# Altium project ESP32 with USBC.PrjPcb
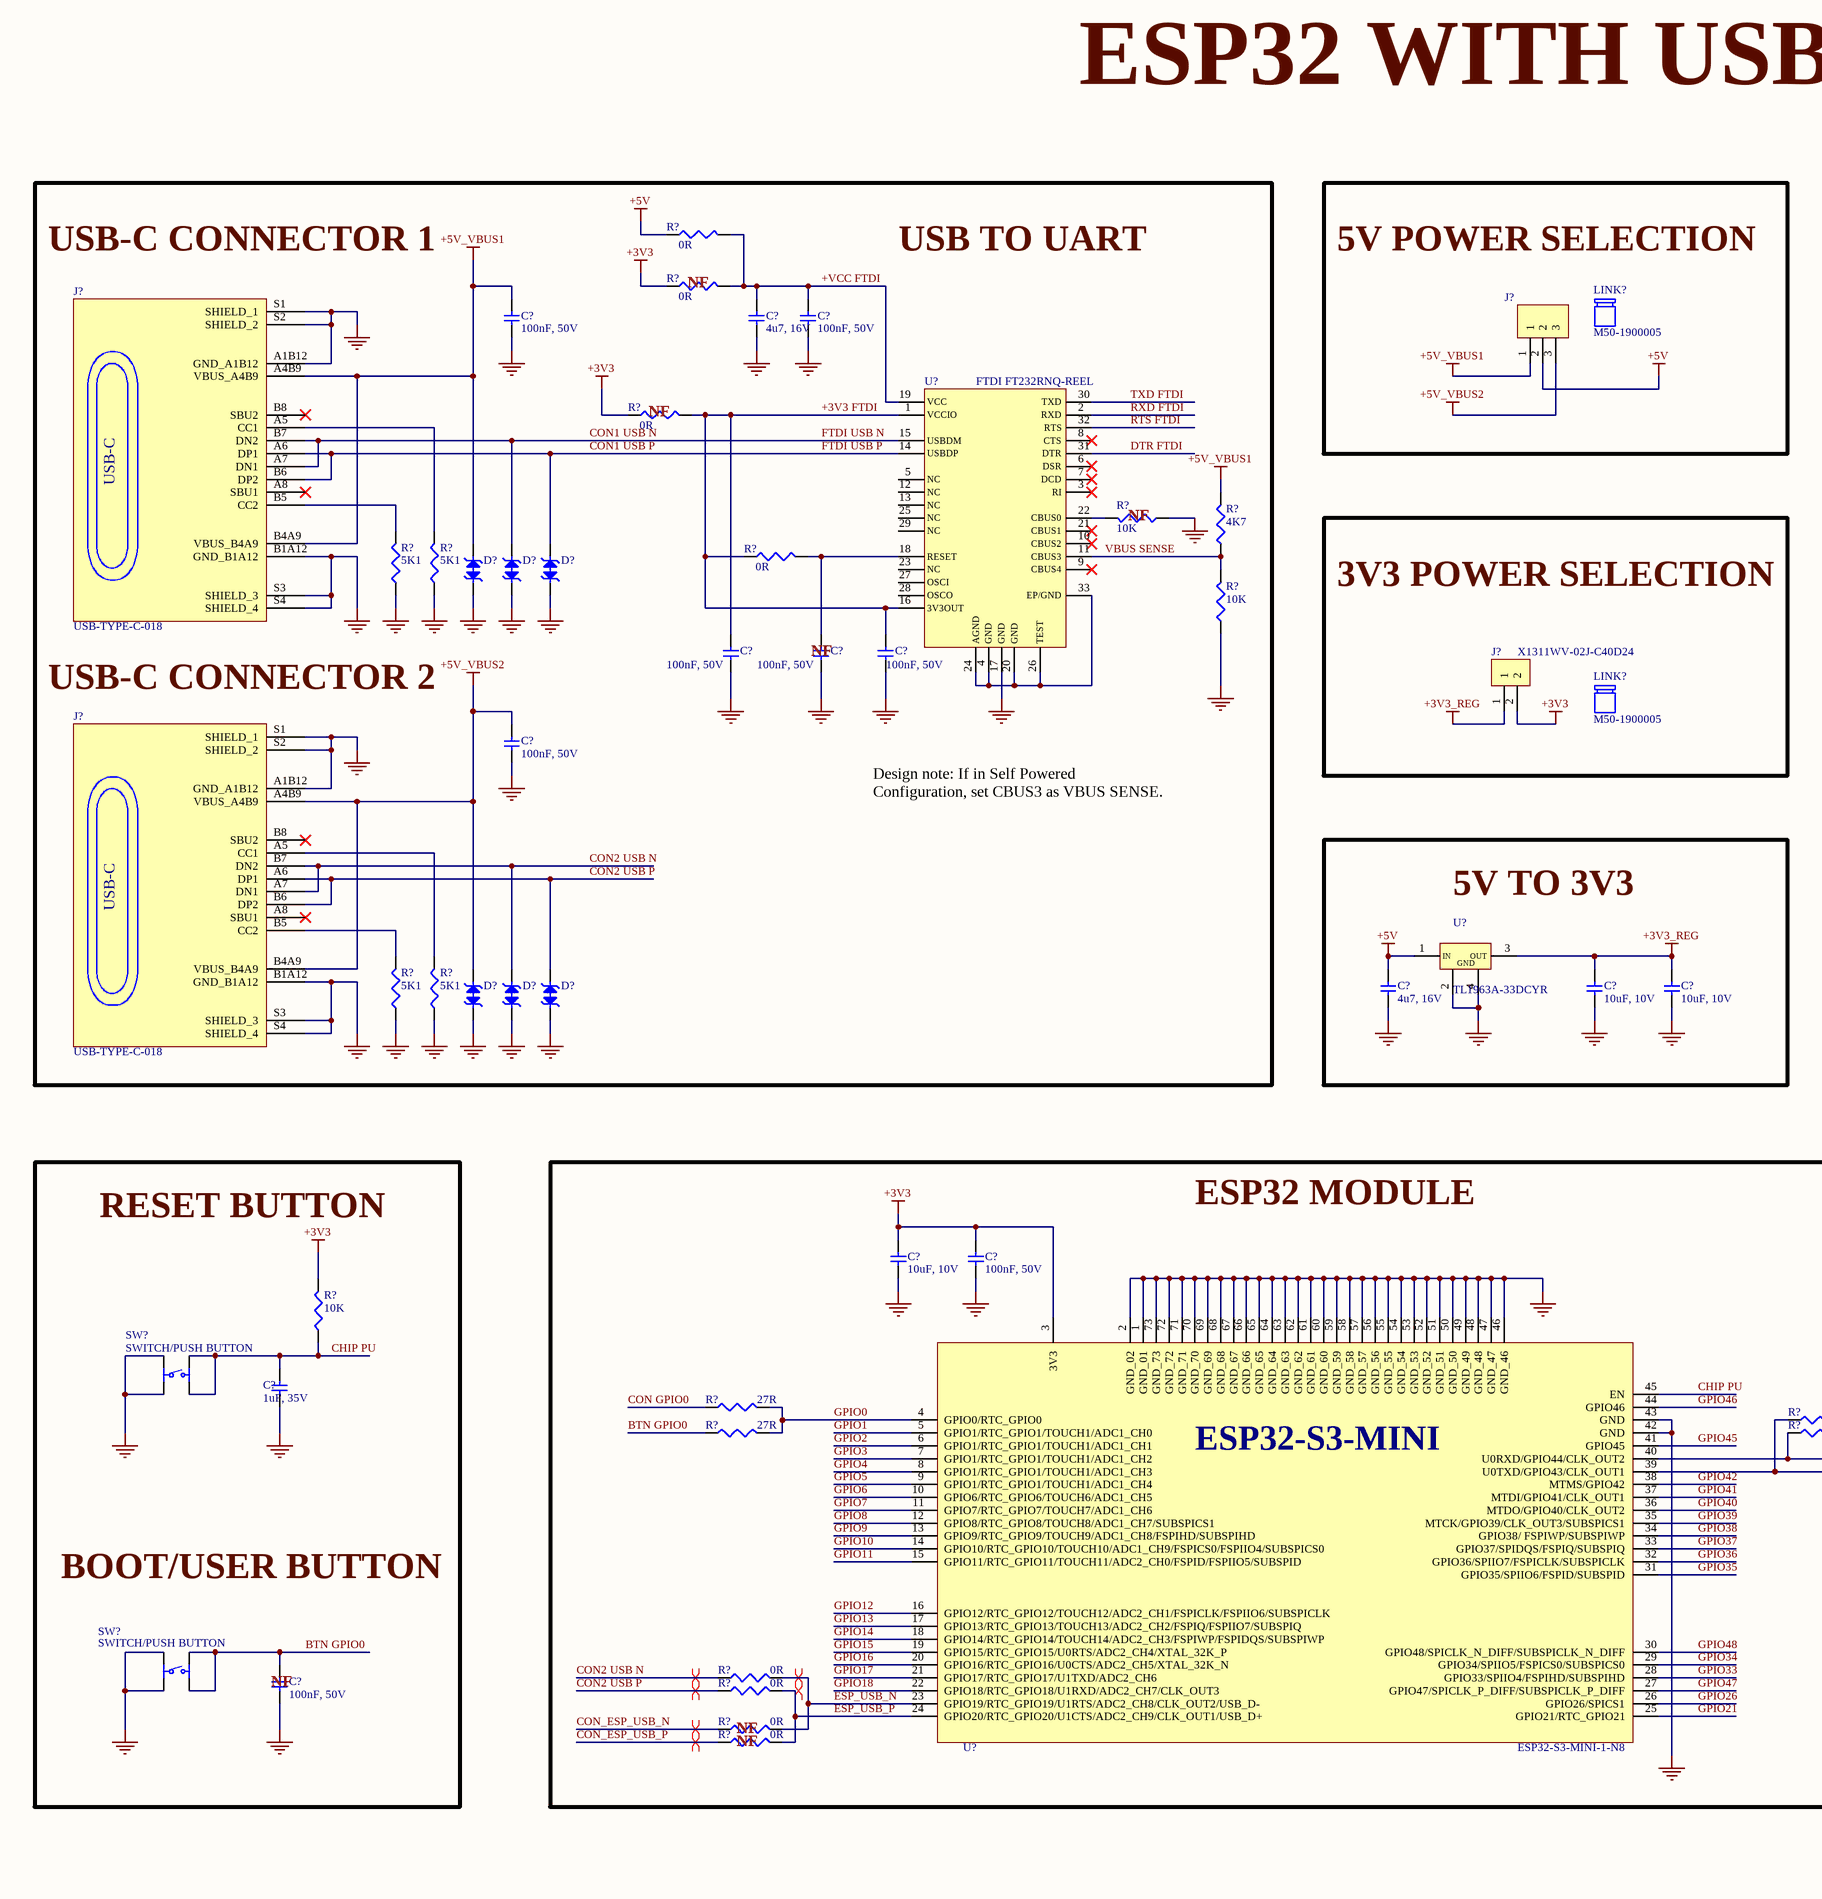
[diagram p0: ESP32 with USBC.SchDoc, left]
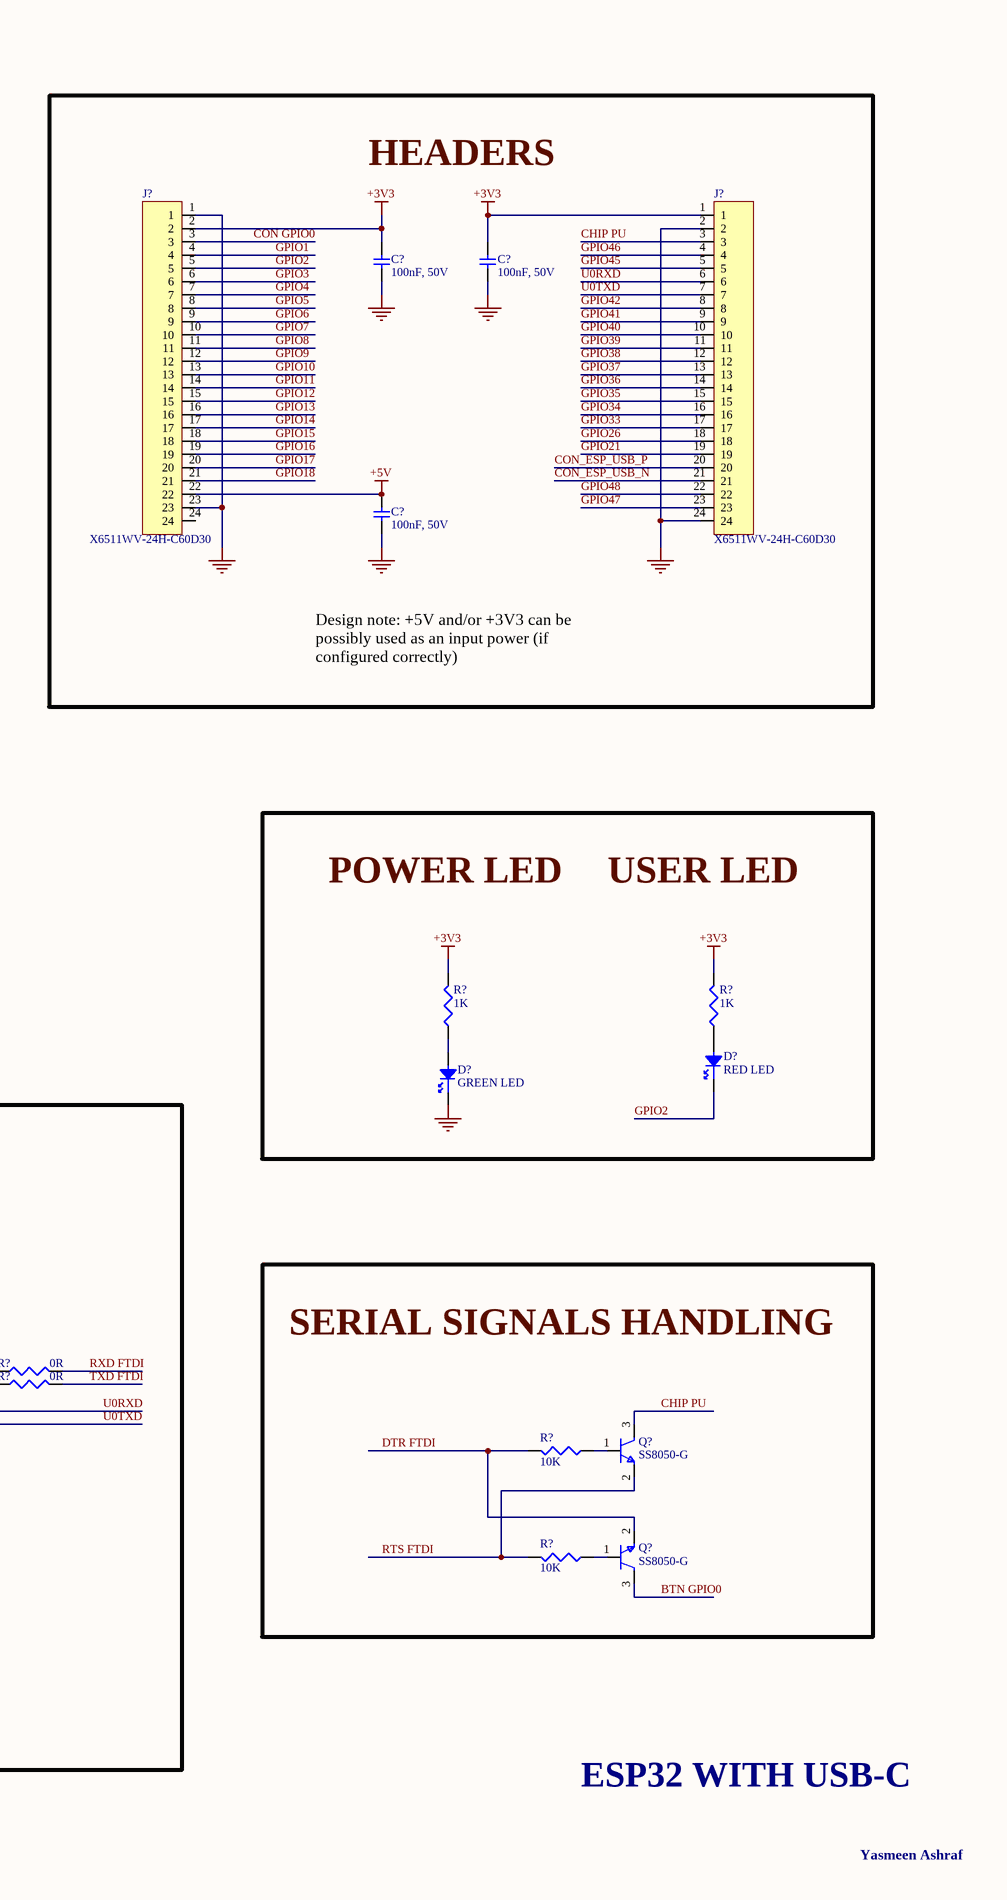
[diagram p1: ESP32 with USBC.SchDoc, right]
1 sheet, 64 parts. Net scope: global (net labels, ports and power ports of the same name join across sheets).
Board file: ESP32 with USBC.PcbDoc

## Sheet ESP32 with USBC.SchDoc
size A2; SheetNumber: 1; SheetTotal: 1

### Parts
(Parts that share a designator on the sheet are numbered #1, #2 ... from top to bottom, then left to right.)
C?#1  100nF, 50V
C?#2  4u7, 16V
C?#3  100nF, 50V
C?#4  100nF, 50V
C?#5  100nF, 50V
C?#6  100nF, 50V
C?#7  100nF, 50V
C?#8  100nF, 50V
C?#9  100nF, 50V
C?#10  100nF, 50V
C?#11  4u7, 16V
C?#12  10uF, 10V
C?#13  10uF, 10V
C?#14  10uF, 10V
C?#15  100nF, 50V
C?#16  1uF, 35V
C?#17  100nF, 50V
D?#1  SP1007-01ETG  (value not drawn)
D?#2  SP1007-01ETG  (value not drawn)
D?#3  SP1007-01ETG  (value not drawn)
D?#4  SP1007-01ETG  (value not drawn)
D?#5  SP1007-01ETG  (value not drawn)
D?#6  SP1007-01ETG  (value not drawn)
D?#7  RED LED
D?#8  GREEN LED
J?#1  X6511WV-24H-C60D30
J?#2  X6511WV-24H-C60D30
J?#3  TSW-103-14-G-S  (value not drawn)
J?#4  USB-TYPE-C-018
J?#5  X1311WV-02J-C40D24
J?#6  USB-TYPE-C-018
LINK?#1  M50-1900005
LINK?#2  M50-1900005
Q?#1  SS8050-G
Q?#2  SS8050-G
R?#1  0R
R?#2  0R
R?#3  0R
R?#4  10K
R?#5  0R
R?#6  4K7
R?#7  5K1
R?#8  5K1
R?#9  10K
R?#10  5K1
R?#11  5K1
R?#12  1K
R?#13  1K
R?#14  10K
R?#15  27R
R?#16  0R
R?#17  27R
R?#18  0R
R?#19  10K
R?#20  10K
R?#21  0R
R?#22  0R
R?#23  0R
R?#24  0R
SW?#1  SWITCH/PUSH BUTTON
SW?#2  SWITCH/PUSH BUTTON
U?#1  FTDI FT232RNQ-REEL
U?#2  TL1963A-33DCYR
U?#3  ESP32-S3-MINI-1-N8

### Blocks framed on the sheet
5V POWER SELECTION: J?#3 LINK?#1
HEADERS: C?#4-C?#6 J?#1 J?#2
3V3 POWER SELECTION: J?#5 LINK?#2
5V TO 3V3: C?#11-C?#13 U?#2
ESP32 MODULE: C?#14 C?#15 R?#15-R?#18 R?#21-R?#24 U?#3
SERIAL SIGNALS HANDLING: Q?#1 Q?#2 R?#19 R?#20

### Nets
+3V3: C?#4.2 C?#5.2 C?#14.2 C?#15.2 J?#1.2 J?#2.1 J?#5.2 R?#2.1 R?#3.1 R?#12.2 R?#13.2 R?#14.2 U?#3.3(3V3)
+3V3_REG: C?#12.2 C?#13.2 J?#5.1 U?#2.3(OUT)
+5V: C?#6.2 C?#11.2 J?#1.22 J?#3.2 R?#1.1 U?#2.1(IN)
+5V_VBUS1: C?#1.2 D?#1.2 J?#3.1 J?#4.A4B9(VBUS_A4B9) J?#4.B4A9(VBUS_B4A9) R?#6.2
+5V_VBUS2: C?#10.2 D?#4.2 J?#3.3 J?#6.A4B9(VBUS_A4B9) J?#6.B4A9(VBUS_B4A9)
GND: C?#1.1 C?#2.1 C?#3.1 C?#4.1 C?#5.1 C?#6.1 C?#7.1 C?#8.1 C?#9.1 C?#10.1 C?#11.1 C?#12.1 C?#13.1 C?#14.1 C?#15.1 C?#16.1 C?#17.1 D?#1.1 D?#2.1 D?#3.1 D?#4.1 D?#5.1 D?#6.1 D?#8.1 J?#1.1 J?#1.23 J?#2.2 J?#2.24 J?#4.A1B12(GND_A1B12) J?#4.B1A12(GND_B1A12) J?#4.S1(SHIELD_1) J?#4.S2(SHIELD_2) J?#4.S3(SHIELD_3) J?#4.S4(SHIELD_4) J?#6.A1B12(GND_A1B12) J?#6.B1A12(GND_B1A12) J?#6.S1(SHIELD_1) J?#6.S2(SHIELD_2) J?#6.S3(SHIELD_3) J?#6.S4(SHIELD_4) R?#4.1 R?#7.1 R?#8.1 R?#9.1 R?#10.1 R?#11.1 SW?#1.1 SW?#1.2 SW?#2.1 SW?#2.2 U?#1.17(GND) U?#2.2(GND) U?#2.4(GND) U?#3.1(GND_01) U?#3.2(GND_02) U?#3.42(GND) U?#3.43(GND) U?#3.46(GND_46) U?#3.47(GND_47) U?#3.48(GND_48) U?#3.49(GND_49) U?#3.50(GND_50) U?#3.51(GND_51) U?#3.52(GND_52) U?#3.53(GND_53) U?#3.54(GND_54) U?#3.55(GND_55) U?#3.56(GND_56) U?#3.57(GND_57) U?#3.58(GND_58) U?#3.59(GND_59) U?#3.60(GND_60) U?#3.61(GND_61) U?#3.62(GND_62) U?#3.63(GND_63) U?#3.64(GND_64) U?#3.65(GND_65) U?#3.66(GND_66) U?#3.67(GND_67) U?#3.68(GND_68) U?#3.69(GND_69) U?#3.70(GND_70) U?#3.71(GND_71) U?#3.72(GND_72) U?#3.73(GND_73)
+3V3 FTDI: C?#7.2 C?#9.2 R?#3.2 R?#5.1 U?#1.1(VCCIO) U?#1.16(3V3OUT)
+VCC FTDI: C?#2.2 C?#3.2 R?#1.2 R?#2.2 U?#1.19(VCC)
BTN GPIO0: C?#17.2 Q?#2.3 R?#17.1 SW?#2.3 SW?#2.4
CHIP PU: C?#16.2 J?#2.3 Q?#1.3 R?#14.1 SW?#1.3 SW?#1.4 U?#3.45(EN)
CON1 USB N: D?#2.2 J?#4.A7(DN1) J?#4.B7(DN2) U?#1.15(USBDM)  [also labelled FTDI USB N]
CON1 USB P: D?#3.2 J?#4.A6(DP1) J?#4.B6(DP2) U?#1.14(USBDP)  [also labelled FTDI USB P]
CON2 USB N: D?#5.2 J?#6.A7(DN1) J?#6.B7(DN2) R?#21.1
CON2 USB P: D?#6.2 J?#6.A6(DP1) J?#6.B6(DP2) R?#22.1
CON GPIO0: J?#1.3 R?#15.1
CON_ESP_USB_N: J?#2.21 R?#23.1
CON_ESP_USB_P: J?#2.20 R?#24.1
DTR FTDI: Q?#2.2 R?#19.2 U?#1.31(DTR)
ESP_USB_N: R?#21.2 R?#23.2 U?#3.23(GPIO19/RTC_GPIO19/U1RTS/ADC2_CH8/CLK_OUT2/USB_D-)
ESP_USB_P: R?#22.2 R?#24.2 U?#3.24(GPIO20/RTC_GPIO20/U1CTS/ADC2_CH9/CLK_OUT1/USB_D+)
GPIO0: R?#15.2 R?#17.2 U?#3.4(GPIO0/RTC_GPIO0)
GPIO1: J?#1.4 U?#3.5(GPIO1/RTC_GPIO1/TOUCH1/ADC1_CH0)
GPIO2: D?#7.1 J?#1.5 U?#3.6(GPIO1/RTC_GPIO1/TOUCH1/ADC1_CH1)
GPIO3: J?#1.6 U?#3.7(GPIO1/RTC_GPIO1/TOUCH1/ADC1_CH2)
GPIO4: J?#1.7 U?#3.8(GPIO1/RTC_GPIO1/TOUCH1/ADC1_CH3)
GPIO5: J?#1.8 U?#3.9(GPIO1/RTC_GPIO1/TOUCH1/ADC1_CH4)
GPIO6: J?#1.9 U?#3.10(GPIO6/RTC_GPIO6/TOUCH6/ADC1_CH5)
GPIO7: J?#1.10 U?#3.11(GPIO7/RTC_GPIO7/TOUCH7/ADC1_CH6)
GPIO8: J?#1.11 U?#3.12(GPIO8/RTC_GPIO8/TOUCH8/ADC1_CH7/SUBSPICS1)
GPIO9: J?#1.12 U?#3.13(GPIO9/RTC_GPIO9/TOUCH9/ADC1_CH8/FSPIHD/SUBSPIHD)
GPIO10: J?#1.13 U?#3.14(GPIO10/RTC_GPIO10/TOUCH10/ADC1_CH9/FSPICS0/FSPIIO4/SUBSPICS0)
GPIO11: J?#1.14 U?#3.15(GPIO11/RTC_GPIO11/TOUCH11/ADC2_CH0/FSPID/FSPIIO5/SUBSPID)
GPIO12: J?#1.15 U?#3.16(GPIO12/RTC_GPIO12/TOUCH12/ADC2_CH1/FSPICLK/FSPIIO6/SUBSPICLK)
GPIO13: J?#1.16 U?#3.17(GPIO13/RTC_GPIO13/TOUCH13/ADC2_CH2/FSPIQ/FSPIIO7/SUBSPIQ)
GPIO14: J?#1.17 U?#3.18(GPIO14/RTC_GPIO14/TOUCH14/ADC2_CH3/FSPIWP/FSPIDQS/SUBSPIWP)
GPIO15: J?#1.18 U?#3.19(GPIO15/RTC_GPIO15/U0RTS/ADC2_CH4/XTAL_32K_P)
GPIO16: J?#1.19 U?#3.20(GPIO16/RTC_GPIO16/U0CTS/ADC2_CH5/XTAL_32K_N)
GPIO17: J?#1.20 U?#3.21(GPIO17/RTC_GPIO17/U1TXD/ADC2_CH6)
GPIO18: J?#1.21 U?#3.22(GPIO18/RTC_GPIO18/U1RXD/ADC2_CH7/CLK_OUT3)
GPIO21: J?#2.19 U?#3.25(GPIO21/RTC_GPIO21)
GPIO26: J?#2.18 U?#3.26(GPIO26/SPICS1)
GPIO33: J?#2.17 U?#3.28(GPIO33/SPIIO4/FSPIHD/SUBSPIHD)
GPIO34: J?#2.16 U?#3.29(GPIO34/SPIIO5/FSPICS0/SUBSPICS0)
GPIO35: J?#2.15 U?#3.31(GPIO35/SPIIO6/FSPID/SUBSPID)
GPIO36: J?#2.14 U?#3.32(GPIO36/SPIIO7/FSPICLK/SUBSPICLK)
GPIO37: J?#2.13 U?#3.33(GPIO37/SPIDQS/FSPIQ/SUBSPIQ)
GPIO38: J?#2.12 U?#3.34(GPIO38/_FSPIWP/SUBSPIWP)
GPIO39: J?#2.11 U?#3.35(MTCK/GPIO39/CLK_OUT3/SUBSPICS1)
GPIO40: J?#2.10 U?#3.36(MTDO/GPIO40/CLK_OUT2)
GPIO41: J?#2.9 U?#3.37(MTDI/GPIO41/CLK_OUT1)
GPIO42: J?#2.8 U?#3.38(MTMS/GPIO42)
GPIO45: J?#2.5 U?#3.41(GPIO45)
GPIO46: J?#2.4 U?#3.44(GPIO46)
GPIO47: J?#2.23 U?#3.27(GPIO47/SPICLK_P_DIFF/SUBSPICLK_P_DIFF)
GPIO48: J?#2.22 U?#3.30(GPIO48/SPICLK_N_DIFF/SUBSPICLK_N_DIFF)
RTS FTDI: Q?#1.2 R?#20.2 U?#1.32(RTS)
RXD FTDI: R?#16.2 U?#1.2(RXD)
TXD FTDI: R?#18.2 U?#1.30(TXD)
U0RXD: J?#2.6 R?#18.1 U?#3.40(U0RXD/GPIO44/CLK_OUT2)
U0TXD: J?#2.7 R?#16.1 U?#3.39(U0TXD/GPIO43/CLK_OUT1)
VBUS SENSE: R?#6.1 R?#9.2 U?#1.11(CBUS3)
NetC?#8_2: C?#8.2 R?#5.2 U?#1.18(RESET)
NetD?#7_2: D?#7.2 R?#13.1
NetD?#8_2: D?#8.2 R?#12.1
NetJ?#4_A5: J?#4.A5(CC1) R?#8.2
NetJ?#4_B5: J?#4.B5(CC2) R?#7.2
NetJ?#6_A5: J?#6.A5(CC1) R?#11.2
NetJ?#6_B5: J?#6.B5(CC2) R?#10.2
NetQ?#1_1: Q?#1.1 R?#19.1
NetQ?#2_1: Q?#2.1 R?#20.1
NetR?#4_2: R?#4.2 U?#1.22(CBUS0)
NetU?#1_4: U?#1.4(GND) U?#1.20(GND) U?#1.24(AGND) U?#1.26(TEST) U?#1.33(EP/GND)

Not connected (* = marked no-connect by the designer): J?#1 24; J?#4 A8(SBU1)* B8(SBU2)*; J?#6 A8(SBU1)* B8(SBU2)*; U?#1 3(RI)* 5(NC) 6(DSR)* 7(DCD)* 8(CTS)* 9(CBUS4)* 10(CBUS2)* 12(NC) 13(NC) 21(CBUS1)* 23(NC) 25(NC) 27(OSCI) 28(OSCO) 29(NC)

### Layout directives
differential pair; differential pair class DIFF90: CON2 USB N, CON2 USB P, CON_ESP_USB_N, CON_ESP_USB_P, ESP_USB_N, ESP_USB_P

### Notes on the sheet
- ESP32 WITH USB-C
- USB-C CONNECTOR 1
- (near R?#2) NF
- USB TO UART
- (near R?#3) NF
- (near R?#4) NF
- (near C?#8) NF
- (near J?#6) USB-C CONNECTOR 2
- Design note: +5V and/or +3V3 can be possibly used as an input power (if configured correctly)
- Design note: If in Self Powered Configuration, set CBUS3 as VBUS SENSE.
- POWER LED
- USER LED
- RESET BUTTON
- BOOT/USER BUTTON
- (near C?#17) NF
- (near R?#23) NF
- (near R?#24) NF
- Yasmeen Ashraf
- (in symbol ESP32-S3-MINI-1-N8) ESP32-S3-MINI
- (in symbol USB-TYPE-C-018) USB-C

### Library data of the parts
C?#1 C?#3-C?#10 C?#15 C?#17 = CL05B104KB54PNC: 50V 100nF X7R ±10% 0402 Multilayer Ceramic Capacitors MLCC - SMD/SMT ROHS; Manufacturer: Samsung; Manufacturer Part Number: CL05B104KB54PNC; Supplier: LCSC; Supplier Part Number: C307331
C?#2 C?#11 = CL05A475MO5NUNC: 16V 4.7uF X5R ±20% 0402 Multilayer Ceramic Capacitors MLCC - SMD/SMT ROHS; Manufacturer: Samsung Electro-Mechanics; Manufacturer Part Number: CL05A475MO5NUNC; Supplier: LCSC; Supplier Name: C318563
C?#12-C?#14 = CL05A106MP8NUB8: 10V 10uF X5R ±20% 0402 Multilayer Ceramic Capacitors MLCC - SMD/SMT ROHS; Manufacturer: Samsung; Manufacturer Part Number: CL05A106MP8NUB8; Supplier: LCSC; Supplier Name: C307415
C?#16 = CL05A105KL5NRNC: 35V 1uF X5R ±10% 0402 Multilayer Ceramic Capacitors MLCC - SMD/SMT ROHS; Manufacturer: Samsung; Manufacturer Part Number: CL05A105KL5NRNC; Supplier: LCSC; Supplier Part Number: C307413
D?#1-D?#6 = SP1007-01ETG: 5A@8/20us 9.2V 7.8V Bidirectional 6V SOD-882 ESD and Surge Protection (TVS/ESD) ROHS; Manufacturer: Littelfuse; Manufacturer Part Number: SP1007-01ETG; Supplier: LCSC; Supplier Part Number: C126836
D?#7 = VLMS1500-GS08: 20mA 54mcd -30℃~+85℃ 631nm Red 130° 75mW 2V 0402 LED Indication - Discrete ROHS; Manufacture Name: Vishay Intertech; Manufacture Part Number: VLMS1500-GS08; Supplier: LCSC; Supplier Part Number: C511370
D?#8 = VLMG1500-GS08: 20mA 35mcd 571nm Yellow Green 130° 2V 0402 LED Indication - Discrete ROHS; Manufacture Name: Vishay Intertech; Manufacture Part Number: VLMG1500-GS08; Supplier: LCSC; Supplier Part Number: C511404
J?#1 J?#2 = X6511WV-24H-C60D30: Gold 250V 3A Policy 2.5mm 24P 260℃ -40℃~+105℃ 2.54mm Single Row Black Brass 2.54mm 1x24P Plugin,P=2.54mm Pin Headers ROHS; Manufacture Name: XKB Connection; Manufacture Part Number: X6511WV-24H-C60D30; Supplier: LCSC; Supplier Part Number: C725956
J?#3 = TSW-103-14-G-S: Gold Direct Insert 3P -55℃~+125℃ 2.54mm Black Single Row Phosphor Bronze Plugin,P=2.54mm Pin Headers ROHS; Manufacturer: Samtec; Manufacturer Part Number: TSW-103-14-G-S; Supplier: LCSC; Supplier Part Number: C7365843
J?#4 J?#6 = USB-TYPE-C-018: 3A 1 Horizontal attachment 16P Female -25℃~+85℃ Type-C SMD USB Connectors ROHS; Manufacture Name: DEALON; Manufacture Part Number: USB-TYPE-C-018; Supplier Part Number: C2927038; Supplier Name: LCSC
J?#5 = X1311WV-02J-C40D24: Gold 250V 3A Policy 1mm 2P 260℃ -40℃~+105℃ 1.27mm Brass Black Single Row 1x2P 1.27mm Plugin,P=1.27mm Pin Headers ROHS; Manufacture Name: XKB Connection; Manufacture Part Number: X1311WV-02J-C40D24; Supplier: LCSC; Supplier Part Number: C5243682
LINK?#1 LINK?#2 = M50-1900005: 1.27mm (0.05") Pitch Closed Top Jumper Socket, black, gold; Manufacturer: Harwin; Manufacturer Part Number: M50-1900005; Supplier: LCSC; Supplier Part Number: C6293276
Q?#1 Q?#2 = SS8050-G: 25V 300mW 120@100mA,1V 1.5A NPN SOT-23 Bipolar (BJT) ROHS; Manufacture Name: Jiangsu Changjing Electronics Technology Co., Ltd.; Manufacture Part Number: SS8050-G(RANGE:120-200); Supplier: LCSC; Supplier Part Number: C164886
R?#1-R?#3 R?#5 R?#16 R?#18 R?#21-R?#24 = RC0402JR-070RL: 62.5mW Thick Film Resistors 50V ±5% 0Ω 0402 Chip Resistor - Surface Mount ROHS; Manufacturer: YAGEO; Manufacturer Part Number: RC0402JR-070RL; Supplier: LCSC; Supplier Part Number: C60485
R?#4 R?#9 R?#14 R?#19 R?#20 = AC0402FR-0710KL: 62.5mW Thick Film Resistors 50V ±100ppm/℃ ±1% 10kΩ 0402 Chip Resistor - Surface Mount ROHS; Manufacturer: Yageo; Manufacturer Part Number: AC0402FR-0710KL; Supplier: LCSC; Supplier Part Number: C144807
R?#6 = RC0402FR-074K7L: 62.5mW Thick Film Resistors 50V ±100ppm/℃ ±1% 4.7kΩ 0402 Chip Resistor - Surface Mount ROHS; Manufacturer: YAGEO; Manufacturer Part Number: RC0402FR-074K7L; Supplier: LCSC; Supplier Name: C105871
R?#7 R?#8 R?#10 R?#11 = RC0402FR-075K1L: 62.5mW Thick Film Resistors 50V ±100ppm/℃ ±1% 5.1kΩ 0402 Chip Resistor - Surface Mount ROHS; Manufacturer: Yageo; Manufacturer Part Number: RC0402FR-075K1L; Supplier: LCSC; Supplier Part Number: C105872
R?#12 R?#13 = RC0402FR-071KL: 62.5mW Thick Film Resistors 50V ±100ppm/℃ ±1% 1kΩ 0402 Chip Resistor - Surface Mount ROHS; Manufacturer: YAGEO; Manufacturer Part Number: RC0402FR-071KL; Supplier: LCSC; Supplier Part Number: C106235
R?#15 R?#17 = RC0402FR-0727RL: 62.5mW Thick Film Resistors 50V ±100ppm/℃ ±1% 27Ω 0402 Chip Resistor - Surface Mount ROHS; Manufacturer: Yageo; Manufacturer Part Number: RC0402FR-0727RL; Supplier: LCSC; Supplier Part Number: C138021
SW?#1 SW?#2 = SWITCH/PUSH BUTTON: SMD Tactile Switches ROHS; Manufacture Name: C&K; Manufacture Part Number: RKCGG140GSMTRLFS; Supplier: LCSC; Supplier Part Number: C2927791
U?#1 = FTDI FT232RNQ-REEL: USB to UART QFN-32(5x5) USB Converters ROHS; Manufacturer: FTDI; Manufacturer Part Number: FT232RNQ-REEL; Supplier: LCSC; Supplier Name: C5441431
U?#2 = TL1963A-33DCYR: 63dB@(120Hz) 1.5A Fixed 3.3V Positive electrode 20V SOT-223 Voltage Regulators - Linear, Low Drop Out (LDO) Regulators ROHS; Manufacturer: Texas Instruments; Manufacturer Part Number: TL1963A-33DCYR; Supplier: LCSC; Supplier Part Number: C181262
U?#3 = ESP32-S3-MINI-1-N8: SMD module, ESP32-S3FN8, 8 MB SPI flash, PCB antenna; Manufacturer: Espressif Systems; Manufacturer Part Number: ESP32-S3-MINI-1-N8; Supplier: LCSC; Supplier Part Number: C2913206